# EasyEDA Pro project SmallStm.eprj

# Schematic SmallStm
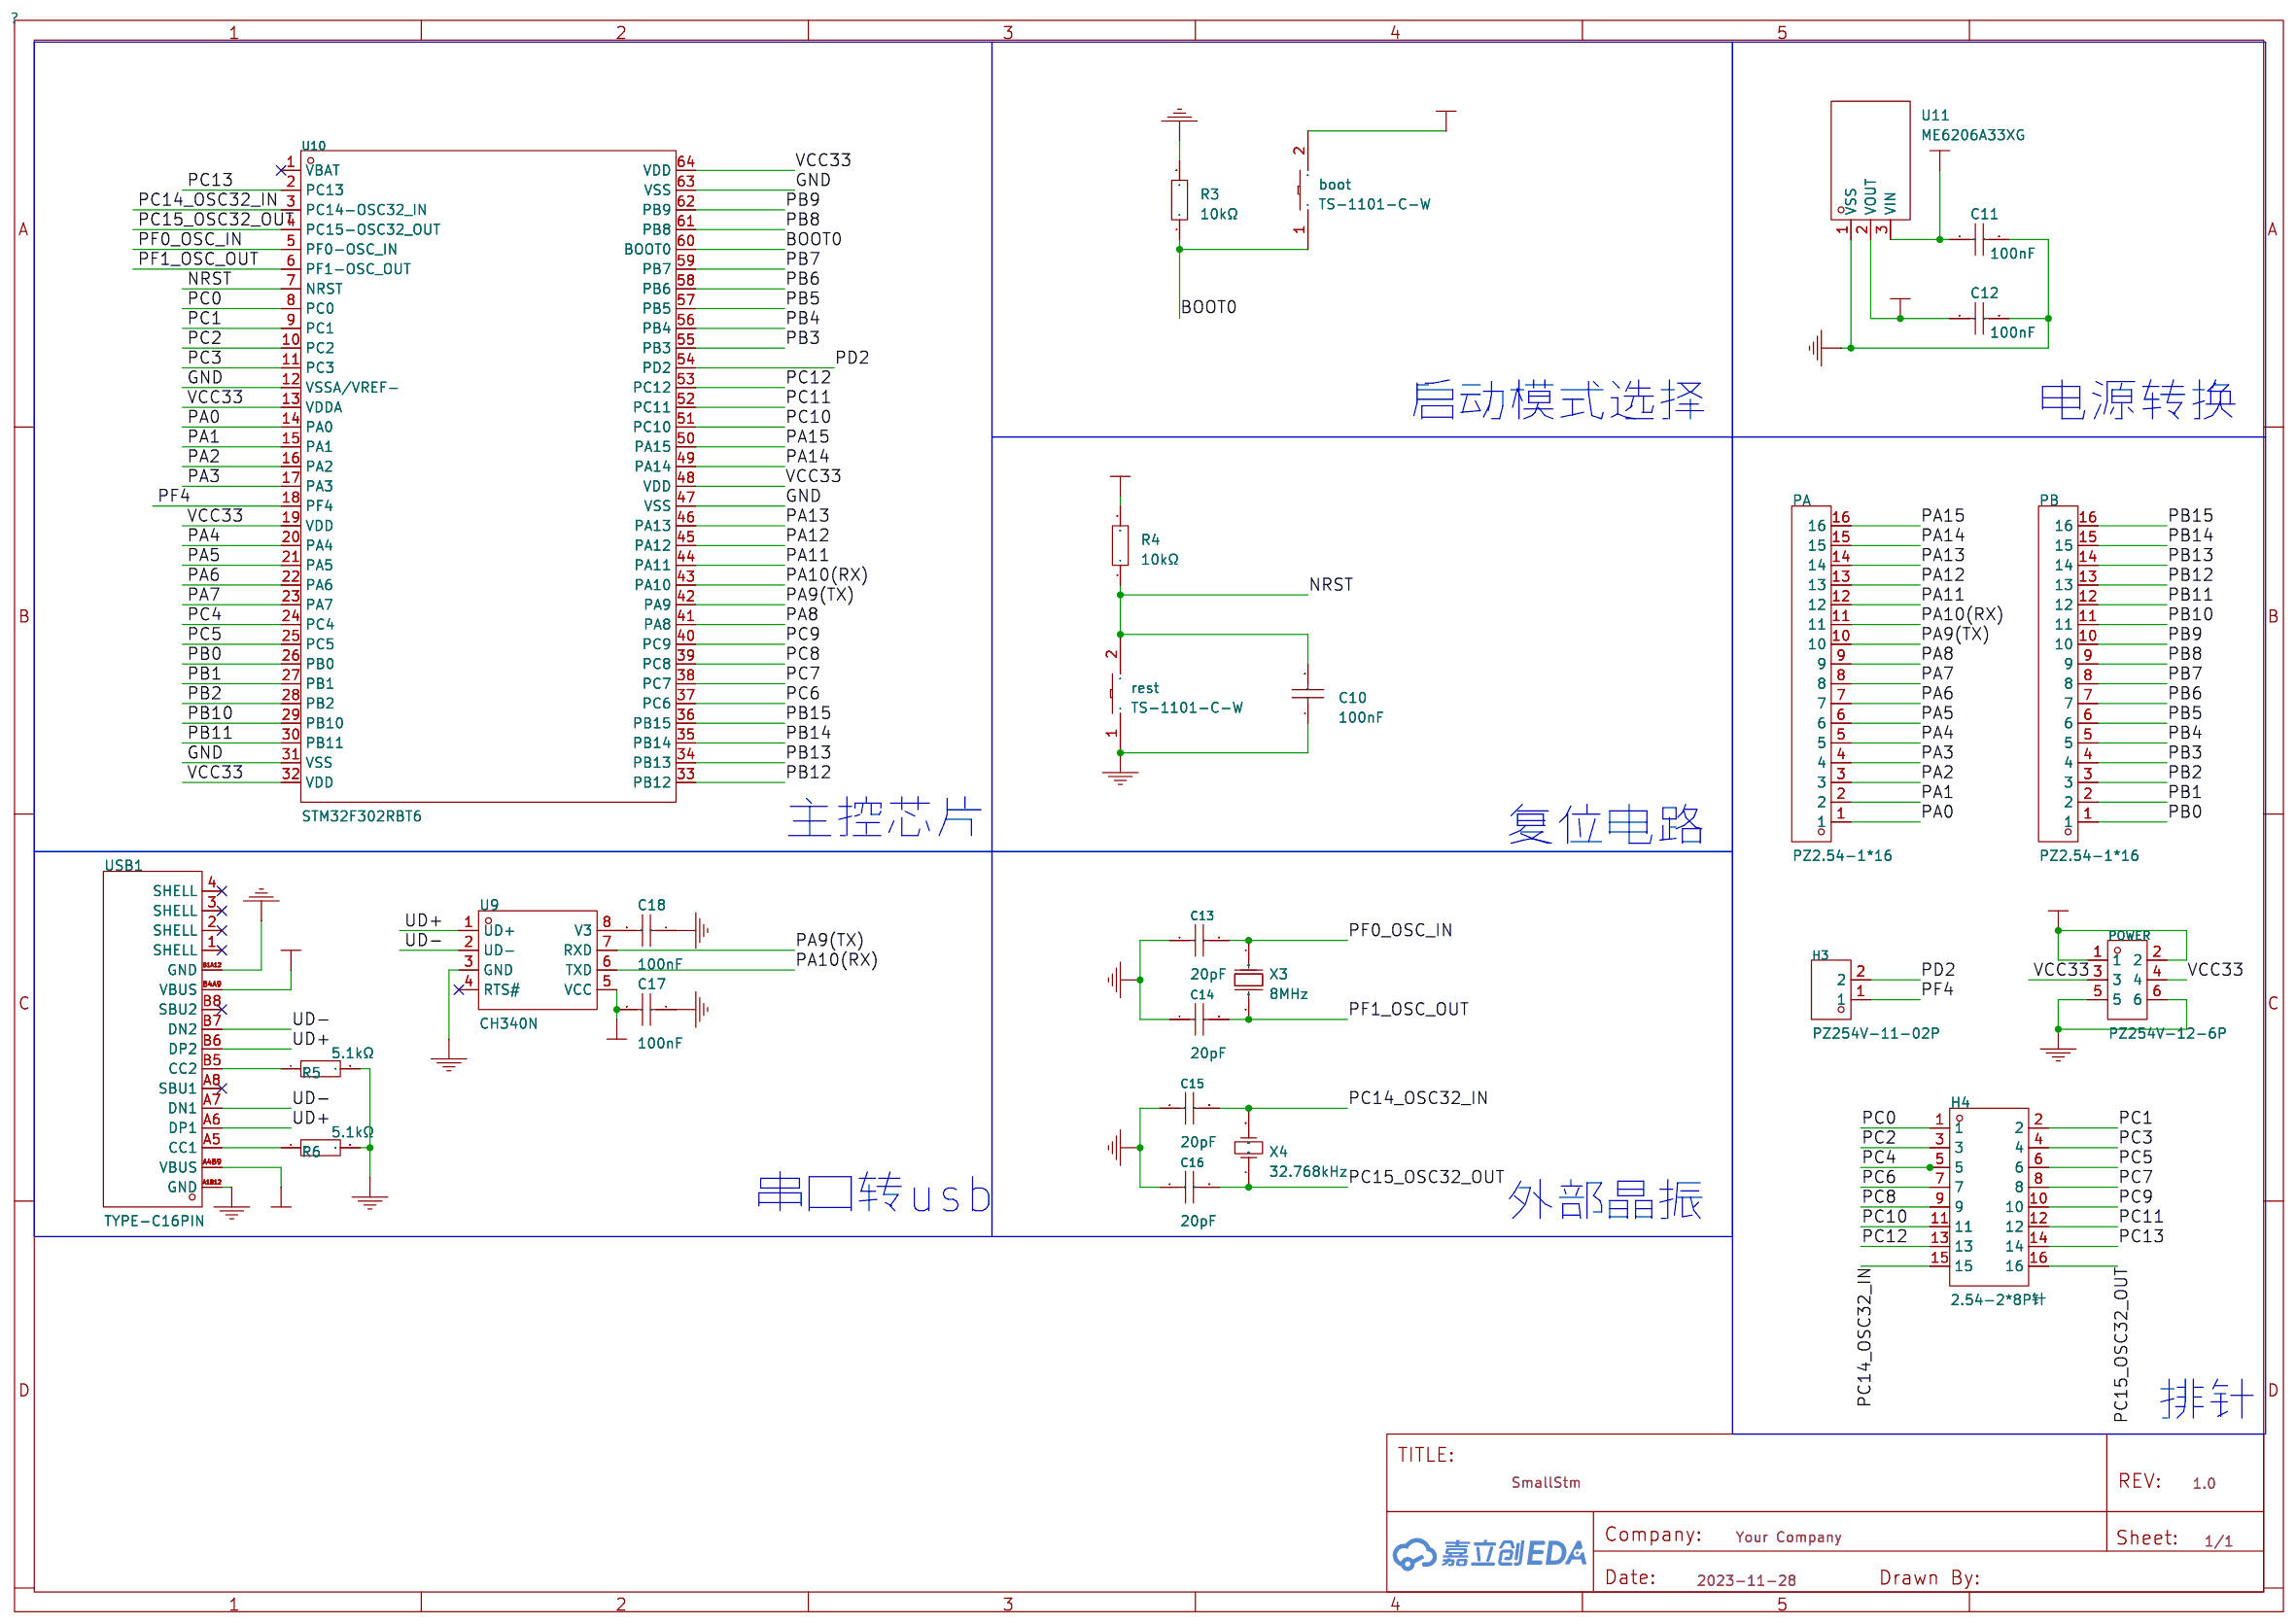
[diagram p0: schematic sheet]

## Parts
boot  TS-1101-C-W  [SW-SMD_L6.0-W3.3-LS8.0]
C10  100nF  [C0603]
C11  100nF  [C0805]
C12  100nF  [C0805]
C13  20pF  [C0402]
C14  20pF  [C0402]
C15  20pF  [C0402]
C16  20pF  [C0402]
C17  100nF  [C0603]
C18  100nF  [C0603]
H3  PZ254V-11-02P  [HDR-TH_2P-P2.54-V-M]
H4  2.54-2*8P针  [HDR-TH_16P-P2.54-V-M-R2-C8-S2.54]
PA  PZ2.54-1*16  [HDR-TH_16P-P2.54-V-M]
PB  PZ2.54-1*16  [HDR-TH_16P-P2.54-V-M]
POWER  PZ254V-12-6P  [HDR-TH_6P-P2.54-V-M-R2-C3-S2.54]
R3  10kΩ  [R0603]
R4  10kΩ  [R0603]
R5  5.1kΩ  [R0603]
R6  5.1kΩ  [R0603]
rest  TS-1101-C-W  [SW-SMD_L6.0-W3.3-LS8.0]
U9  CH340N  [SOP-8_L4.9-W3.9-P1.27-LS6.0-BL]
U10  STM32F302RBT6  [LQFP-64_L10.0-W10.0-P0.50-LS12.0-BL]
U11  ME6206A33XG  [SOT-23-3_L2.9-W1.6-P1.90-LS2.8-BR]
USB1  TYPE-C16PIN  [USB-C-SMD_TYPE-C16PIN]
X3  8MHz  [CRYSTAL-SMD_L11.5-W4.8-LS12.7]
X4  32.768kHz  [OSC-TH_BD3.1-P0.8-D0.3]

## Library data of the parts
boot rest = TS-1101-C-W: 电路结构:单刀单掷;带支架:否;触点电流:50mA;额定电压(AC):-;额定电压(DC):12V;额定功率:-;安装方式:立贴;绝缘电阻:-;带灯:无;作用力:260gf;机械寿命:5万次;; LCSC Part Name: 6*3.6*2.5mm 立贴 轻触开关 白色带淡绿按键 卷装; Supplier Part: C318938; Manufacturer: XKB Connectivity(中国星坤); Supplier Footprint: SMD; JLCPCB Part Class: Extended Part; Datasheet: https://atta.szlcsc.com/upload/public/pdf/source/20200227/C318938_C2E53B1EEDE37D980A33616AC086DE53.pdf; Supplier: LCSC; Circuit: 单刀单掷; Actuator Style: 矩形按钮; Switch Length: 6mm; Switch Width: 3.6mm; Switch Height: 2.5mm; Strike Gundam: 否; Contact Current: 50mA; Voltage Rating (DC): 12V; Mounting Style: 立贴; Actuator/Cap Color: 白色带淡绿; With Lamp: 无; Operating Force: 260gf; Mechanical Life: 5万次; Operating Temperature: -30℃~+85℃
C10 C17 C18 = 0603B104K500NT: 容值:100nF;精度:±10%;额定电压:50V;材质(温度系数):X7R;; LCSC Part Name: 100nF ±10% 50V; Supplier Part: C30926; Manufacturer: FH(风华); Supplier Footprint: 0603; JLCPCB Part Class: Extended Part; Datasheet: https://atta.szlcsc.com/upload/public/pdf/source/20170923/C30926_1506149436298988724.pdf; Supplier: LCSC; Tolerance: ±10%; Voltage Rated: 50V; Temperature Coefficient: X7R
C11 C12 = 0805B104K500NT: 容值:100nF;精度:±10%;额定电压:50V;材质(温度系数):X7R;; LCSC Part Name: 100nF ±10% 50V; Supplier Part: C38141; Manufacturer: FH(风华); Supplier Footprint: 0805; JLCPCB Part Class: Extended Part; Datasheet: https://atta.szlcsc.com/upload/public/pdf/source/20170923/C38141_1506149447419988747.pdf; Supplier: LCSC; Tolerance: ±10%; Voltage Rated: 50V; Temperature Coefficient: X7R
C13-C16 = 0402CG200J500NT: 容值:20pF;精度:±5%;额定电压:50V;材质(温度系数):C0G;; LCSC Part Name: 20pF ±5% 50V; Supplier Part: C1554; Manufacturer: FH(风华); Supplier Footprint: 0402; JLCPCB Part Class: Basic Part; Datasheet: https://atta.szlcsc.com/upload/public/pdf/source/20200305/C486355_26A10D38EF8C2A5C37091D0039909270.pdf; Supplier: LCSC; Tolerance: ±5%; Voltage Rated: 50V; Temperature Coefficient: C0G
H3 = PZ254V-11-02P: 排数:单排;总PIN位数:2P;间距:2.54mm;插针结构:1x2P;行距:-;安装类型:直插;圆针/方针:方针;额定电流:-;额定电压:-;配合针长度:6mm;塑高:2.5mm;端接针长度:3mm;触头材质:黄铜;触头镀层:-;工作温度范围:-40℃~+105℃;颜色:黑色;; LCSC Part Name: 2.54mm 1x2P 直插 方针; Supplier Part: C492401; Manufacturer: XFCN(兴飞); Supplier Footprint: 插件,P=2.54mm; JLCPCB Part Class: Extended Part; Datasheet: https://atta.szlcsc.com/upload/public/pdf/source/20200309/C492401_A812433581A9B211A7FFA413ADDFF0E5.pdf; Supplier: LCSC; Number of Rows: 单排; Number of Pins: 2P; Pitch: 2.54mm; Pin Structure: 1x2P; Mounting Type: 直插; Circluar Pins/Square Pins: 方针; Length of Mating Pin: 6mm; Insulation Height: 2.5mm; Length of End Connection Pin: 3mm; Contact Material: 黄铜; Operating Temperature Range: -40℃~+105℃; Color: 黑色
H4 = 2.54-2*8P针_C779499: 圆针/方针:-;额定电流:-;额定电压:-;配合针长度:-;塑高:-;触头材质:-;; LCSC Part Name: 双排直插 2*8排针 2.54mm; Supplier Part: C779499; Manufacturer: BOOMELE(博穆精密); Supplier Footprint: 插件,P=2.54mm; JLCPCB Part Class: Extended Part; Datasheet: https://atta.szlcsc.com/upload/public/pdf/source/20221201/C605E3BE9C0F7226363017EFD1BDE852.pdf; Supplier: LCSC
PA PB = PZ2.54-1*16: LCSC Part Name: 排针 2.54mm 1x16P镀金; Supplier Part: C5360903; Manufacturer: ZHOURI(洲日); Supplier Footprint: DIP; Supplier: LCSC
POWER = PZ254V-12-6P: 排数:双排;总PIN位数:6P;间距:2.54mm;插针结构:2x3P;行距:2.54mm;安装类型:直插;圆针/方针:方针;额定电流:-;额定电压:-;配合针长度:6mm;塑高:2.5mm;端接针长度:3mm;触头材质:黄铜;触头镀层:-;工作温度范围:-40℃~+105℃;颜色:黑色;; LCSC Part Name: 2.54mm 2x3P 直插 方针; Supplier Part: C492420; Manufacturer: XFCN(兴飞); Supplier Footprint: 插件,P=2.54mm; JLCPCB Part Class: Extended Part; Datasheet: https://atta.szlcsc.com/upload/public/pdf/source/20200309/C492420_BAECB307B001054C09D200388220EAE6.pdf; Supplier: LCSC; Number of Rows: 双排; Number of Pins: 6P; Pitch: 2.54mm; Pin Structure: 2x3P; Row Spacing: 2.54mm; Mounting Type: 直插; Circluar Pins/Square Pins: 方针; Length of Mating Pin: 6mm; Insulation Height: 2.5mm; Length of End Connection Pin: 3mm; Contact Material: 黄铜; Operating Temperature Range: -40℃~+105℃; Color: 黑色
R3 R4 = 0603WAF1002T5E: 阻值:10kΩ;精度:±1%;功率:100mW;温度系数:±100ppm/℃;电阻类型:厚膜电阻;; LCSC Part Name: 10kΩ ±1% 100mW 厚膜电阻; Supplier Part: C25804; Manufacturer: UNI-ROYAL(厚声); Supplier Footprint: 0603; JLCPCB Part Class: Basic Part; Datasheet: https://atta.szlcsc.com/upload/public/pdf/source/20200306/C422600_1E6D84923E4A46A82E41ADD87F860B5C.pdf; Supplier: LCSC; Tolerance: ±1%; Power(Watts): 100mW; Overload Voltage (Max): 75V; Temperature Coefficient: ±100ppm/℃; Type: 厚膜电阻; Operating Temperature Range: -55℃~+155℃
R5 R6 = 0603WAF5101T5E: 阻值:5.1kΩ;精度:±1%;功率:100mW;温度系数:±100ppm/℃;电阻类型:厚膜电阻;; LCSC Part Name: 5.1kΩ ±1% 100mW 厚膜电阻; Supplier Part: C23186; Manufacturer: UNI-ROYAL(厚声); Supplier Footprint: 0603; JLCPCB Part Class: Basic Part; Datasheet: https://atta.szlcsc.com/upload/public/pdf/source/20200306/C422600_1E6D84923E4A46A82E41ADD87F860B5C.pdf; Supplier: LCSC; Tolerance: ±1%; Power(Watts): 100mW; Overload Voltage (Max): 75V; Temperature Coefficient: ±100ppm/℃; Type: 厚膜电阻; Operating Temperature Range: -55℃~+155℃
U9 = CH340N: LCSC Part Name: USB转串口芯片 CH340; Supplier Part: C2977777; Manufacturer: WCH(南京沁恒); Supplier Footprint: SOP-8; JLCPCB Part Class: Extended Part; Datasheet: https://atta.szlcsc.com/upload/public/pdf/source/20230530/6E401E9554E9F5311886CC8B3F89B62E.pdf; Supplier: LCSC
U10 = STM32F302RBT6: CPU内核:ARM Cortex-M4;CPU最大主频:72MHz;工作电压范围:2V~3.6V;程序存储容量:128KB;程序存储器类型:FLASH;RAM总容量:32KB;GPIO端口数量:52;; Supplier Part: C915559; Manufacturer: ST(意法半导体); Supplier Footprint: LQFP-64(10x10); JLCPCB Part Class: Extended Part; Datasheet: https://atta.szlcsc.com/upload/public/pdf/source/20201118/C915559_8F62CF0CC919D825BFE6EAA2D3BA6178.pdf; Supplier: LCSC; CPU Core: ARM Cortex-M4; CPU Maximum Speed: 72MHz; Operating Voltage Range: 2V~3.6V; Program Storage Size: 128KB; Program Memory Type: FLASH; RAM Size: 32KB; GPIO Ports Number: 52; ADC (Bit): 12bit; DAC (Bit): 12bit; Universal Serial Bus: 有; Peripheral/Function: DMA；看门狗；看门狗; Watchdog: 有; Infrared Data Association: 有; Low-Voltage Detect: 有; Direct Memory Access: 有; Internal Oscillator: 有; Operating Temperature Range: -40℃~+85℃
U11 = ME6206A33XG: 输出类型:固定;输出极性:正;最大输入电压:6V;输出电压:3.3V;输出电流:300mA;电源纹波抑制比(PSRR):50dB@(1kHz);; LCSC Part Name: 输入6V 输出3.3V 300mA; Supplier Part: C161345; Manufacturer: MICRONE(南京微盟); Supplier Footprint: SOT-23; JLCPCB Part Class: Extended Part; Datasheet: https://atta.szlcsc.com/upload/public/pdf/source/20180207/C161345_15179949863651359188.pdf; Supplier: LCSC; Output Type: 固定; Output Polarity: 正; Number of Outputs: 1; Maximum Input Voltage: 6V; Output Voltage: 3.3V; Dropout Voltage: 400mV@(200mA); Output Current: 300mA; Power Supply Rejection Ratio (PSRR): 50dB@(1kHz)
USB1 = TYPE-C16PIN: 连接器类型:Type-C;标准:-;公母:母;触点数量:16P;端口数量:1;安装方式:卧贴;额定电流 - 电源:3A;工作温度范围:-40℃~+85℃;; LCSC Part Name: Type-C 母 卧贴 快充闪充; Supplier Part: C393939; Manufacturer: SHOU HAN(首韩); Supplier Footprint: SMD; JLCPCB Part Class: Extended Part; Datasheet: https://atta.szlcsc.com/upload/public/pdf/source/20190521/C393939_7B9043D4CF1026AF443AB60D91FBCD5C.pdf; Supplier: LCSC; Connector Type: Type-C; Gender: 母; Number of Contacts: 16P; Number of Ports: 1; Mounting Style: 卧贴; Current Rating - Power (Max): 3A; Operating Temperature Range: -40℃~+85℃
X3 = X49SM8MSD2SC: 频率:8MHz;负载电容:20pF;频率公差:±20ppm;; LCSC Part Name: 8MHz ±20ppm 20pF HC-49SMD; Supplier Part: C12674; Manufacturer: YXC(扬兴晶振); Supplier Footprint: HC-49S-SMD; JLCPCB Part Class: Basic Part; Datasheet: https://atta.szlcsc.com/upload/public/pdf/source/20210329/C106809_0E91E60850A780B284B63D653DC40EA4.pdf; Supplier: LCSC; Crystal Type: 49SMD; Load Capacitance: 20pF; Frequency Tolerance: ±20ppm; Frequency Stability: ±30ppm; Operating Temperature: -20℃~+70℃
X4 = X308032768KGB2SC: 频率:32.768kHz;负载电容:12.5pF;频率公差:±10ppm;; LCSC Part Name: 32.768kHz ±10ppm 12.5pF YT-38; Supplier Part: C52082; Manufacturer: YXC(扬兴晶振); Supplier Footprint: DT-38; JLCPCB Part Class: Extended Part; Datasheet: https://atta.szlcsc.com/upload/public/pdf/source/20210729/394323D37097DADF5DA3ECA9C1DCF4BF.pdf; Supplier: LCSC; Crystal Type: 圆柱体晶振; Load Capacitance: 12.5pF; Frequency Tolerance: ±10ppm; Operating Temperature: -20℃~+70℃

## Nets
GND: C10.1 C11.2 C12.2 C13.1 C14.1 C15.1 C16.1 C17.1 C18.1 POWER.5 POWER.6 R3.2 R5.2 R6.2 rest.1 U9.3(GND) U10.12(VSSA/VREF-) U10.31(VSS) U10.47(VSS) U10.63(VSS) U11.1(VSS) USB1.A1B12(GND) USB1.B1A12(GND)
VCC5: C11.1 C17.2 POWER.1 POWER.2 U9.5(VCC) U11.3(VIN) USB1.A4B9(VBUS) USB1.B4A9(VBUS)
VCC33: boot.2 C12.1 POWER.3 POWER.4 R4.2 U10.13(VDDA) U10.19(VDD) U10.32(VDD) U10.48(VDD) U10.64(VDD) U11.2(VOUT)
BOOT0: boot.1 R3.1 U10.60(BOOT0)
NRST: C10.2 R4.1 rest.2 U10.7(NRST)
PA0: PA.1 U10.14(PA0)
PA1: PA.2 U10.15(PA1)
PA2: PA.3 U10.16(PA2)
PA3: PA.4 U10.17(PA3)
PA4: PA.5 U10.20(PA4)
PA5: PA.6 U10.21(PA5)
PA6: PA.7 U10.22(PA6)
PA7: PA.8 U10.23(PA7)
PA8: PA.9 U10.41(PA8)
PA9(TX): PA.10 U9.7(RXD) U10.42(PA9)
PA10(RX): PA.11 U9.6(TXD) U10.43(PA10)
PA11: PA.12 U10.44(PA11)
PA12: PA.13 U10.45(PA12)
PA13: PA.14 U10.46(PA13)
PA14: PA.15 U10.49(PA14)
PA15: PA.16 U10.50(PA15)
PB0: PB.1 U10.26(PB0)
PB1: PB.2 U10.27(PB1)
PB2: PB.3 U10.28(PB2)
PB3: PB.4 U10.55(PB3)
PB4: PB.5 U10.56(PB4)
PB5: PB.6 U10.57(PB5)
PB6: PB.7 U10.58(PB6)
PB7: PB.8 U10.59(PB7)
PB8: PB.9 U10.61(PB8)
PB9: PB.10 U10.62(PB9)
PB10: PB.11 U10.29(PB10)
PB11: PB.12 U10.30(PB11)
PB12: PB.13 U10.33(PB12)
PB13: PB.14 U10.34(PB13)
PB14: PB.15 U10.35(PB14)
PB15: PB.16 U10.36(PB15)
PC0: H4.1 U10.8(PC0)
PC1: H4.2 U10.9(PC1)
PC2: H4.3 U10.10(PC2)
PC3: H4.4 U10.11(PC3)
PC4: H4.5 U10.24(PC4)
PC5: H4.6 U10.25(PC5)
PC6: H4.7 U10.37(PC6)
PC7: H4.8 U10.38(PC7)
PC8: H4.9 U10.39(PC8)
PC9: H4.10 U10.40(PC9)
PC10: H4.11 U10.51(PC10)
PC11: H4.12 U10.52(PC11)
PC12: H4.13 U10.53(PC12)
PC13: H4.14 U10.2(PC13)
PC14_OSC32_IN: C15.2 H4.15 U10.3(PC14-OSC32_IN) X4.2(OSC2)
PC15_OSC32_OUT: C16.2 H4.16 U10.4(PC15-OSC32_OUT) X4.1(OSC1)
PD2: H3.2 U10.54(PD2)
PF0_OSC_IN: C13.2 U10.5(PF0-OSC_IN) X3.1(OSC1)
PF1_OSC_OUT: C14.2 U10.6(PF1-OSC_OUT) X3.2(OSC2)
PF4: H3.1 U10.18(PF4)
UD+: U9.1(UD+) USB1.A6(DP1) USB1.B6(DP2)
UD-: U9.2(UD-) USB1.A7(DN1) USB1.B7(DN2)
$1N492: R5.1 USB1.B5(CC2)
$1N493: R6.1 USB1.A5(CC1)
$1N4015: C18.2 U9.8(V3)

Not connected (* = marked no-connect by the designer): U9 4(RTS#)*; U10 1(VBAT)*; USB1 1(SHELL)* 2(SHELL)* 3(SHELL)* 4(SHELL)* A8(SBU1)* B8(SBU2)*

## Notes on the sheet
- 启动模式选择
- 电源转换
- 主控芯片
- 复位电路
- 串口转usb
- 外部晶振
- 排针

# Board PCB3
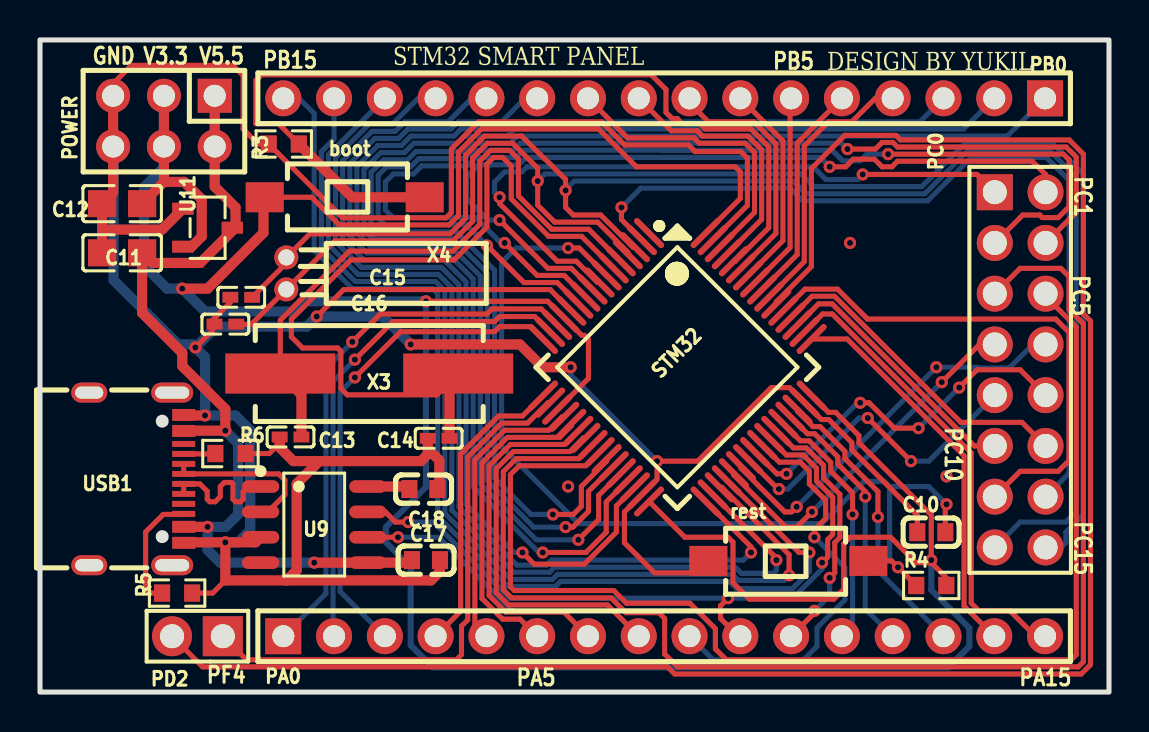
[diagram p1: board, top side]
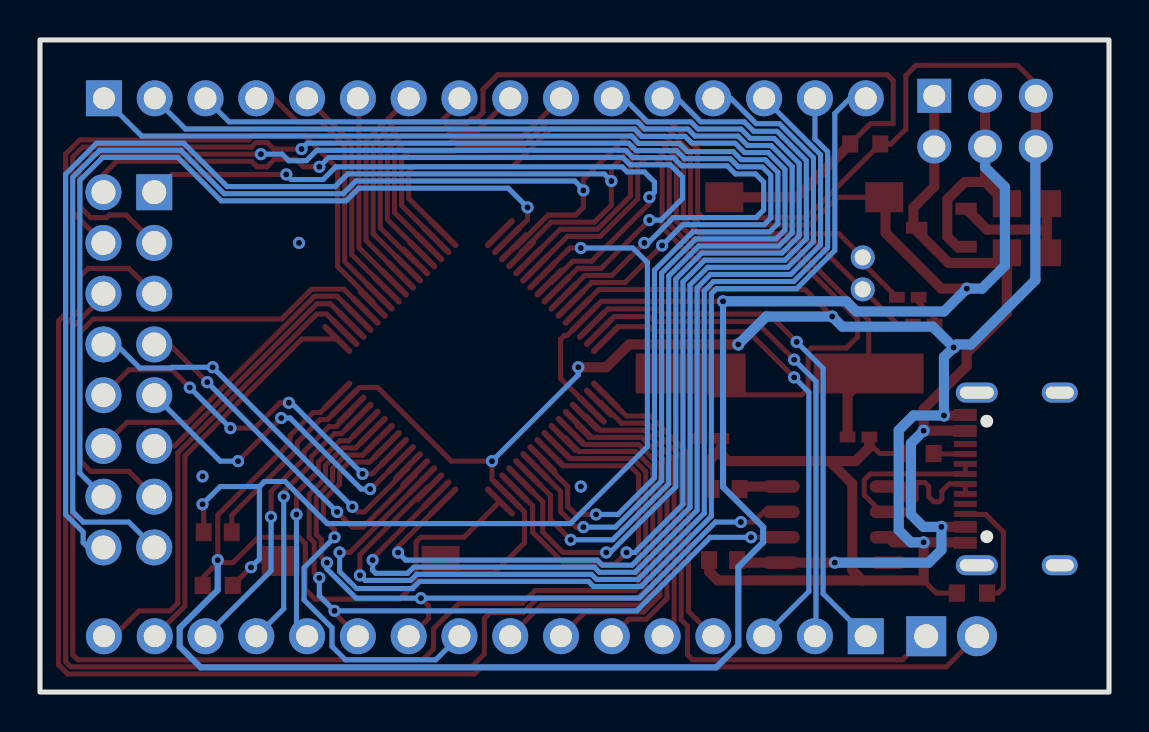
[diagram p2: board, bottom side, seen from below]

Outline 53.47 x 32.64 mm; copper layers: Top Layer, Bottom Layer. Coordinates in mm from the lower left corner of the outline.
Outline path: rectangle 0,32.64 53.47,0
Stack: Top Layer 0.035mm / Dielectric1 1.51mm FR4 er 4.5 / Bottom Layer 0.035mm

## Design rules (mm)
template: JLCPCB Capability(Two Layers Board)
spacing copperThickness1oz (default): track to track 0.102, other pairs 0.152 to 0.3
spacing copperThickness2oz: track to track 0.203, other pairs 0.152 to 0.3
track width copperThickness1oz (default): min 0.127, default 0.254, max 2.54
track width copperThickness2oz: min 0.203, default 0.254, max 2.54
differential pair differentialPair (default): width min 0.127, default 0.254, max 2.54; gap min 0.152, default 0.152
via viaSize (default): diameter min 0.5, default 0.61, max 10; hole min 0.3, default 0.305, max 6.3

## Placement (name value [footprint] x y rotation side)
boot  TS-1101-C-W  [SW-SMD_L6.0-W3.3-LS8.0]  15.24 24.77 180 top
C10  100nF  [C0603]  44.58 8 0 top
C11  100nF  [C0805]  4.11 21.99 180 top
C12  100nF  [C0805]  4.11 24.44 180 top
C13  20pF  [C0402]  12.53 12.77 0 top
C14  20pF  [C0402]  19.94 12.7 0 top
C15  20pF  [C0402]  10.07 19.76 0 top
C16  20pF  [C0402]  9.27 18.41 0 top
C17  100nF  [C0603]  19.3 6.6 180 top
C18  100nF  [C0603]  19.18 10.16 180 top
PA0  PZ2.54-1*16  [HDR-TH_16P-P2.54-V-M]  31.22 2.79 0 top
PB0  PZ2.54-1*16  [HDR-TH_16P-P2.54-V-M]  31.22 29.72 180 top
PC0  2.54-2*8P针  [HDR-TH_16P-P2.54-V-M-R2-C8-S2.54]  49.02 16.13 270 top
PD2  PZ254V-11-02P  [HDR-TH_2P-P2.54-V-M]  7.87 2.79 180 top
POWER  PZ254V-12-6P  [HDR-TH_6P-P2.54-V-M-R2-C3-S2.54]  6.2 28.58 180 top
R3  10kΩ  [R0603]  12.19 27.43 180 top
R4  10kΩ  [R0603]  44.58 5.33 0 top
R5  5.1kΩ  [R0603]  6.86 4.95 0 top
R6  5.1kΩ  [R0603]  9.52 11.94 0 top
rest  TS-1101-C-W  [SW-SMD_L6.0-W3.3-LS8.0]  37.43 6.56 0 top
STM32  STM32F302RBT6  [LQFP-64_L10.0-W10.0-P0.50-LS12.0-BL]  31.88 16.26 225 top
U9  CH340N  [SOP-8_L4.9-W3.9-P1.27-LS6.0-BL]  13.72 8.38 270 top
U11  ME6206A33XG  [SOT-23-3_L2.9-W1.6-P1.90-LS2.8-BR]  8.38 23.24 180 top
USB1  TYPE-C16PIN  [USB-C-SMD_TYPE-C16PIN]  4.83 10.67 270 top
X3  8MHz  [CRYSTAL-SMD_L11.5-W4.8-LS12.7]  16.47 15.94 0 top
X4  32.768kHz  [OSC-TH_BD3.1-P0.8-D0.3]  12.32 20.95 180 top

## Footprints (pads in the part's own frame, mm; a bottom-side part is the same pattern mirrored in y, then rotated)
C0402
  rect 0.79x0.54 smd: 1(-0.545,0) 2(0.545,0)
C0603
  rect 0.8x0.9 smd: 1(-0.7,0) 2(0.7,0)
C0805
  rect 1.41x1.35 smd: 1(-1,0) 2(1,0)
CRYSTAL-SMD_L11.5-W4.8-LS12.7
  rect 5.5x2 smd: 1(-4.45,0) 2(4.45,0)
HDR-TH_2P-P2.54-V-M
  rect 2x2 hole 1.2: 1(-1.27,0)
  round 2 hole 1.2: 2(1.27,0)
HDR-TH_6P-P2.54-V-M-R2-C3-S2.54
  rect 1.7x1.7 hole 1.1: 1(-2.54,-1.27)
  round 1.7 hole 1.1: 2(-2.54,1.27) 3(0,-1.27) 4(0,1.27) 5(2.54,-1.27) 6(2.54,1.27)
HDR-TH_16P-P2.54-V-M
  rect 1.8x1.8 hole 1.1: 1(-19.05,0)
  round 1.8 hole 1.1: 2(-16.51,0) 3(-13.97,0) 4(-11.43,0) 5(-8.89,0) 6(-6.35,0) 7(-3.81,0) 8(-1.27,0) 9(1.27,0) 10(3.81,0) 11(6.35,0) 12(8.89,0) 13(11.43,0) 14(13.97,0) 15(16.51,0) 16(19.05,0)
HDR-TH_16P-P2.54-V-M-R2-C8-S2.54
  rect 1.8x1.8 hole 1.2: 1(-8.89,-1.27)
  round 1.8 hole 1.2: 2(-8.89,1.27) 3(-6.35,-1.27) 4(-6.35,1.27) 5(-3.81,-1.27) 6(-3.81,1.27) 7(-1.27,-1.27) 8(-1.27,1.27) 9(1.27,-1.27) 10(1.27,1.27) 11(3.81,-1.27) 12(3.81,1.27) 13(6.35,-1.27) 14(6.35,1.27) 15(8.89,-1.27) 16(8.89,1.27)
LQFP-64_L10.0-W10.0-P0.50-LS12.0-BL
  oval 0.3x2 smd: 1(-3.75,-5.75) 2(-3.25,-5.75) 3(-2.75,-5.75) 4(-2.25,-5.75) 5(-1.75,-5.75) 6(-1.25,-5.75) 7(-0.75,-5.75) 8(-0.25,-5.75) 9(0.25,-5.75) 10(0.75,-5.75) 11(1.25,-5.75) 12(1.75,-5.75) 13(2.25,-5.75) 14(2.75,-5.75) 15(3.25,-5.75) 16(3.75,-5.75) 33(3.75,5.75) 34(3.25,5.75) 35(2.75,5.75) 36(2.25,5.75) 37(1.75,5.75) 38(1.25,5.75) 39(0.75,5.75) 40(0.25,5.75) 41(-0.25,5.75) 42(-0.75,5.75) 43(-1.25,5.75) 44(-1.75,5.75) 45(-2.25,5.75) 46(-2.75,5.75) 47(-3.25,5.75) 48(-3.75,5.75)
  oval 2x0.3 smd: 17(5.75,-3.75) 18(5.75,-3.25) 19(5.75,-2.75) 20(5.75,-2.25) 21(5.75,-1.75) 22(5.75,-1.25) 23(5.75,-0.75) 24(5.75,-0.25) 25(5.75,0.25) 26(5.75,0.75) 27(5.75,1.25) 28(5.75,1.75) 29(5.75,2.25) 30(5.75,2.75) 31(5.75,3.25) 32(5.75,3.75) 49(-5.75,3.75) 50(-5.75,3.25) 51(-5.75,2.75) 52(-5.75,2.25) 53(-5.75,1.75) 54(-5.75,1.25) 55(-5.75,0.75) 56(-5.75,0.25) 57(-5.75,-0.25) 58(-5.75,-0.75) 59(-5.75,-1.25) 60(-5.75,-1.75) 61(-5.75,-2.25) 62(-5.75,-2.75) 63(-5.75,-3.25) 64(-5.75,-3.75)
OSC-TH_BD3.1-P0.8-D0.3
  round 1.2 hole 0.8: 1(0,0.8) 2(0,-0.8)
R0603
  rect 0.806x0.864 smd: 1(-0.753,0) 2(0.753,0)
SOP-8_L4.9-W3.9-P1.27-LS6.0-BL
  oval 0.63x1.865 smd: 1(-1.905,-2.683) 2(-0.635,-2.683) 3(0.635,-2.683) 4(1.905,-2.683) 5(1.905,2.683) 6(0.635,2.683) 7(-0.635,2.683) 8(-1.905,2.683)
SOT-23-3_L2.9-W1.6-P1.90-LS2.8-BR
  rect 1.07x0.6 smd: 1(1.235,-0.95) 2(1.235,0.95) 3(-1.235,0)
SW-SMD_L6.0-W3.3-LS8.0
  rect 1.9x1.5 smd: 1(-4,0) 2(4,0)
USB-C-SMD_TYPE-C16PIN
  oval 1x2.1 hole 0.6x1.7: 1(-4.32,1.788) 2(4.32,1.788)
  oval 1x1.8 hole 0.6x1.4: 3(-4.32,-2.362) 4(4.32,-2.362)
  rect 0.6x1.15 smd: A1B12(-3.2,2.362) A4B9(-2.4,2.362) B1A12(3.2,2.362) B4A9(2.4,2.362)
  rect 0.3x1.15 smd: A5(-1.25,2.362) A6(-0.25,2.362) A7(0.25,2.362) A8(-1.75,2.362) B5(1.75,2.362) B6(0.75,2.362) B7(-0.75,2.362) B8(1.25,2.362)

## Nets
GND: C10.1 C11.2 C12.2 C13.1 C14.1 C15.1 C16.1 C17.1 C18.1 POWER.5 POWER.6 R3.2 R5.2 R6.2 rest.1 STM32.12 STM32.31 STM32.47 STM32.63 U9.3 U11.1 USB1.A1B12 USB1.B1A12
VCC5: C11.1 C17.2 POWER.1 POWER.2 U9.5 U11.3 USB1.A4B9 USB1.B4A9
VCC33: boot.2 C12.1 POWER.3 POWER.4 R4.2 STM32.13 STM32.19 STM32.32 STM32.48 STM32.64 U11.2
BOOT0: boot.1 R3.1 STM32.60
NRST: C10.2 R4.1 rest.2 STM32.7
PA0: PA0.1 STM32.14
PA1: PA0.2 STM32.15
PA2: PA0.3 STM32.16
PA3: PA0.4 STM32.17
PA4: PA0.5 STM32.20
PA5: PA0.6 STM32.21
PA6: PA0.7 STM32.22
PA7: PA0.8 STM32.23
PA8: PA0.9 STM32.41
PA9(TX): PA0.10 STM32.42 U9.7
PA10(RX): PA0.11 STM32.43 U9.6
PA11: PA0.12 STM32.44
PA12: PA0.13 STM32.45
PA13: PA0.14 STM32.46
PA14: PA0.15 STM32.49
PA15: PA0.16 STM32.50
PB0: PB0.1 STM32.26
PB1: PB0.2 STM32.27
PB2: PB0.3 STM32.28
PB3: PB0.4 STM32.55
PB4: PB0.5 STM32.56
PB5: PB0.6 STM32.57
PB6: PB0.7 STM32.58
PB7: PB0.8 STM32.59
PB8: PB0.9 STM32.61
PB9: PB0.10 STM32.62
PB10: PB0.11 STM32.29
PB11: PB0.12 STM32.30
PB12: PB0.13 STM32.33
PB13: PB0.14 STM32.34
PB14: PB0.15 STM32.35
PB15: PB0.16 STM32.36
PC0: PC0.1 STM32.8
PC1: PC0.2 STM32.9
PC2: PC0.3 STM32.10
PC3: PC0.4 STM32.11
PC4: PC0.5 STM32.24
PC5: PC0.6 STM32.25
PC6: PC0.7 STM32.37
PC7: PC0.8 STM32.38
PC8: PC0.9 STM32.39
PC9: PC0.10 STM32.40
PC10: PC0.11 STM32.51
PC11: PC0.12 STM32.52
PC12: PC0.13 STM32.53
PC13: PC0.14 STM32.2
PC14_OSC32_IN: C15.2 PC0.15 STM32.3 X4.2
PC15_OSC32_OUT: C16.2 PC0.16 STM32.4 X4.1
PD2: PD2.2 STM32.54
PF0_OSC_IN: C13.2 STM32.5 X3.1
PF1_OSC_OUT: C14.2 STM32.6 X3.2
PF4: PD2.1 STM32.18
UD+: U9.1 USB1.A7 USB1.B6
UD-: U9.2 USB1.A6 USB1.B7
$1N492: R5.1 USB1.B5
$1N493: R6.1 USB1.A5
$1N4015: C18.2 U9.8

Pads without a net: STM32 1; U9 4; USB1 1 2 3 4 A8 B8

## Via types
v1: diameter 0.61, hole 0.305, Top Layer to Bottom Layer, 63 vias

## Routing (per net, layer and track width the routed paths; a pad name or vN(x,y) marks a point on that pad's centre or on a via; arc(x,y) is an arc through that point)
GND: length 196.5
  Top Layer w0.254: 11.99,12.46 11.47,11.94 R6.2 ; POWER.5 3.66,30.46 4.57,31.37 9.65,31.37 10.16,30.86 10.16,28.18 10.91,27.43 R3.2 15.14,23.74 20.31,23.74 20.57,24 20.57,27.18 21.93,28.54 28.08,28.54 29.24,27.38 32.44,27.38 32.77,27.05 35.05,27.05 35.38,26.72 35.38,24.36 STM32.63 ; v1(13.84,18.8) 15.19,20.14 25.52,20.14 STM32.12 ; R5.2 8.64,4.95 9.27,5.59 ; C10.1 43.88,8.85 40.61,12.12 40.61,12.48 39.45,13.64 39.09,13.64 STM32.47 37.49,15.24 36.58,15.24 32.89,11.56 v1(30.86,11.56) 30.86,10.64 STM32.31 29.23,9.01 29.23,7.47 30.73,5.97 32.83,5.97 rest.1 ; C15.1 9.52,19.51 8.63,18.62 8.63,18.11 v1(7.77,17.25)
  Top Layer w0.508: 3.11,23.15 C12.2 3.66,24.99 POWER.6 POWER.5 ; 3.11,23.15 C11.2 ; 3.11,23.15 6.1,23.15 U11.1 ; 19.39,12.18 19.39,11.9 19.05,11.56 13.97,11.56 ; 19.39,12.18 C14.1 ; 19.39,12.18 19.97,11.6 19.97,10.31 ; 13.97,11.56 12.84,10.42 12.84,6.1 12.33,5.59 ; 13.97,11.56 12.67,11.56 11.99,12.24 C13.1 ; v1(8.25,13.84) 7.21,13.84 USB1.A1B12 ; 12.33,5.59 9.27,5.59 v1(9.27,7.49) ; 12.33,5.59 19.56,5.59 20,6.03 C17.1 ; v1(18.54,17.4) 24,17.4 25.15,16.26 v1(26.54,16.26) ; v1(9.27,7.49) 7.21,7.49 USB1.B1A12 ; v1(9.27,7.49) 10.78,7.49 U9.3
  Bottom Layer w0.254: v1(30.86,11.56) 26.54,15.88 v1(26.54,16.26)
  Bottom Layer w0.508: v1(7.77,17.25) 8.81,18.29 13.33,18.29 v1(13.84,18.8) 17.14,18.8 v1(18.54,17.4) ; v1(7.77,17.25) 7.62,17.4 6.9,17.4 3.68,20.62 3.68,27.28 POWER.6 ; v1(7.77,17.25) 8.25,16.76 v1(8.25,13.84) 9.78,13.84 10.52,13.11 10.52,8.1 9.91,7.49 v1(9.27,7.49)
  vias: v1(26.42,10.29) v1(40.51,22.48) v1(45.34,10.8)
VCC5: length 44.5
  Top Layer w0.508: USB1.B4A9 v1(8.38,8.27) ; v1(13.72,6.48) U9.5 18.48,6.48 C17.2 ; USB1.A4B9 7.2,13.08 v1(9.27,13.08) 9.27,14.16 7.12,16.32 7.12,16.97 5.11,18.98 C11.1 5.14,21.99 5.65,21.48 8.02,21.48 9.78,23.24 9.78,24.26 8.74,25.3 POWER.2 POWER.1
  Bottom Layer w0.508: v1(9.27,13.08) 9.91,12.45 9.91,8.89 9.28,8.27 v1(8.38,8.27) 8.38,7.11 9.02,6.48 v1(13.72,6.48)
VCC33: length 171.3
  Top Layer w0.254: v1(19.3,19.56) 25.39,19.56 STM32.13 27.1,17.85 27.23,17.85 27.43,17.65 27.43,15.7 STM32.19 ; boot.2 13.59,24.77 14.97,23.38 20.45,23.38 20.93,23.86 20.93,27.03 22.08,28.18 27.94,28.18 29.83,26.29 34.77,26.29 35.03,26.03 35.03,24.71 STM32.64 ; 30.46,9.54 32.25,7.75 34.42,7.75 34.66,7.5 34.66,5.47 35.48,4.65 39.7,4.65 40.2,5.15 40.2,7.43 40.52,7.75 42.55,7.75 43.81,6.48 44.58,6.48 ; 44.58,6.48 45.58,5.47 45.58,5.33 ; 44.58,6.48 44.58,8.86 40.96,12.48 40.96,12.83 39.8,14 39.44,14 STM32.48
  Top Layer w0.508: U11.2 7.58,22.29 8.09,22.8 8.09,24.66 7.21,25.53 6.2,25.53 ; 6.2,25.53 C12.1 ; 6.2,25.53 POWER.4 POWER.3 ; boot.2 11.18,24.7 11.18,22.99 8.38,20.19 v1(7.11,20.19)
  Bottom Layer w0.305: v1(19.3,19.56) 19.3,10.26 17.3,8.25 17.3,7.49 18.54,6.25 18.54,2.34 19.64,1.23 45.43,1.23 46.48,2.29 46.48,3.2 44.58,5.11 v1(44.58,6.6)
  Bottom Layer w0.508: POWER.4 6.2,26.27 5.21,25.27 5.21,21.34 6.35,20.19 v1(7.11,20.19) 8.25,19.05 12.64,19.05 13.15,19.56 v1(19.3,19.56)
BOOT0: length 46.6
  Top Layer w0.254: R3.1 11.93,28.45 10.8,28.45 10.8,30.61 11.09,30.9 30.57,30.9 31.31,30.16 31.31,29.02 31.62,28.7 31.88,28.7 32.13,28.45 33.02,28.45 33.28,28.18 35.56,28.18 36.45,27.29 36.45,23.24 34.77,21.56 34.7,21.56
  Top Layer w0.508: R3.1 15.61,24.77 boot.1
NRST: length 49.1
  Top Layer w0.254: rest.2 42.59,6.56 v1(42.91,6.24) R4.1 ; C10.2 45.28,9.34 v1(45.34,9.4) ; STM32.7 26.97,22.22 v1(26.42,22.22)
  Bottom Layer w0.254: v1(42.91,6.24) 42.49,6.66 42.49,10.29 ; 42.49,10.29 44.45,10.29 v1(45.34,9.4) ; 42.49,10.29 42.24,10.54 41.21,10.54 39.1,8.43 26.94,8.43 23.09,12.28 23.09,21.5 23.81,22.22 v1(26.42,22.22)
PA0: length 27.4
  Top Layer w0.254: STM32.14 25.07,19.18 22.61,19.18 22.35,18.92 17.02,18.92 v1(15.62,17.53)
  Bottom Layer w0.254: PA0.1 14.3,4.93 14.3,16.21 v1(15.62,17.53)
PA1: length 25.3
  Top Layer w0.254: v1(15.75,16.64) 17.65,18.54 22.73,18.54 22.99,18.8 24.74,18.8 25.51,18.02
  Bottom Layer w0.254: v1(15.75,16.64) 14.66,15.55 14.66,2.85 PA0.2
PA2: length 24.9
  Top Layer w0.254: STM32.16 24.54,18.29 22.99,18.29 22.73,18.03 18.03,18.03 v1(15.75,15.75)
  Bottom Layer w0.254: v1(15.75,15.75) 15.01,15.01 15.01,5.03 PA0.3
PA3: length 15
  Top Layer w0.254: PA0.4 21.04,4.05 21.04,11.92 22.94,13.82 24.13,13.82 STM32.17
PA4: length 14.4
  Top Layer w0.254: PA0.5 21.75,3.37 21.75,11.62 23.23,13.1 25.44,13.1 26.12,13.78 STM32.20
PA5: length 15.7
  Top Layer w0.254: STM32.21 26.57,13.33 25.99,12.75 23.38,12.75 22.11,11.47 22.11,4.68 23.14,3.65 24.01,3.65 PA0.6
PA6: length 17.5
  Top Layer w0.254: STM32.22 26.25,12.39 23.53,12.39 22.46,11.33 22.46,4.83 23.29,4 26.2,4 PA0.7
PA7: length 19.3
  Top Layer w0.254: PA0.8 28.38,4.36 23.44,4.36 22.82,4.98 22.82,11.18 23.67,12.04 26.5,12.04 27.18,12.72 STM32.23
PA8: length 20.6
  Top Layer w0.254: STM32.41 36.98,11.51 38.02,11.51 38.48,11.05 38.48,10.41 39.29,9.6 39.29,8.69 38.73,8.13 v1(38.73,7.75)
  Bottom Layer w0.254: v1(38.73,7.75) 40.26,6.22 40.26,4.61 38.86,3.22 38.86,2.29 38.19,1.61 33.67,1.61 PA0.9
PA9(TX): length 36.2
  Top Layer w0.254: 36.47,12.72 37.33,11.86 38.17,11.86 38.84,11.2 38.84,10.56 39.65,9.75 39.65,7.88 39.4,7.63 39.4,6.76 v1(39.12,6.48) ; PA0.10 34.92,2.79 34.04,3.68 34.04,4.32 v1(34.42,4.7) ; v1(18.42,8.51) 17.78,8.51 17.27,9.02 U9.7
  Bottom Layer w0.254: v1(18.42,8.51) 19.68,8.51 23.49,4.7 v1(34.42,4.7) 37.65,4.7 39.12,6.16 v1(39.12,6.48)
PA10(RX): length 36.8
  Top Layer w0.254: STM32.43 37.68,12.22 38.32,12.22 39.19,11.35 39.19,10.71 40.01,9.9 40.01,7.74 39.75,7.48 39.75,5.97 v1(39.5,5.72) ; PA0.11 38.73,3.96 v1(38.73,4.06) ; v1(17.91,7.75) U9.6
  Bottom Layer w0.254: v1(39.5,5.72) 39.5,4.83 v1(38.73,4.06) 23.62,4.06 19.94,7.75 v1(17.91,7.75)
PA11: length 12.5
  Top Layer w0.254: v1(40.64,8.89) 40.64,9.97 39.55,11.06 39.55,11.5 38.47,12.57 38.03,12.57 STM32.44
  Bottom Layer w0.254: PA0.12 40.64,3.33 v1(40.64,8.89)
PA12: length 13.3
  Top Layer w0.254: STM32.45 38.39,12.93 38.74,12.93 39.9,11.77 39.9,11.41 41.27,10.04 v1(41.27,9.78)
  Bottom Layer w0.254: PA0.13 41.27,4.17 v1(41.27,9.78)
PA13: length 14.6
  Top Layer w0.254: v1(41.91,8.76) 41.91,10.03 40.26,11.68 40.26,12.04 39.02,13.29 38.66,13.29 37.89,14.06 STM32.46
  Bottom Layer w0.254: PA0.14 41.91,6.07 v1(41.91,8.76)
PA14: length 19.7
  Top Layer w0.254: STM32.49 40.37,17.67 46.22,11.83 46.22,4.3 PA0.15
PA15: length 23.5
  Top Layer w0.254: PA0.16 49.78,2.79 48.51,4.06 46.96,4.06 46.57,4.45 46.57,11.97 39.62,18.92 39.14,18.92 STM32.50
PB0: length 63.5
  Top Layer w0.254: STM32.26 28.34,11.56 27.08,10.3 27.08,9.3 26.67,8.89 v1(25.65,8.89)
  Bottom Layer w0.254: v1(25.65,8.89) 24.56,8.89 22.73,10.72 22.73,21.12 20.81,23.04 16.97,23.04 16.56,23.44 16.56,26.01 17.19,26.64 18.39,26.64 18.8,27.05 21.08,27.05 21.49,27.46 23.51,27.46 23.88,27.83 48.38,27.83 PB0.1
PB1: length 62.6
  Top Layer w0.254: STM32.27 27.43,10.04 27.43,9.04 26.65,8.25 v1(26.29,8.25)
  Bottom Layer w0.254: v1(26.29,8.25) 24.69,8.25 22.38,10.57 22.38,20.97 20.67,22.68 16.65,22.68 16.2,23.13 16.2,26.16 17.04,27 18.23,27 18.7,27.47 20.86,27.47 21.2,27.81 23.36,27.81 23.73,28.18 46.19,28.18 PB0.2
PB2: length 61.8
  Top Layer w0.254: v1(26.92,7.62) 27.94,8.64 27.94,9.84 29.05,10.95
  Bottom Layer w0.254: v1(26.92,7.62) 24.82,7.62 22.02,10.42 22.02,20.82 20.52,22.33 16.51,22.33 15.85,22.98 15.85,26.31 16.9,27.36 18.08,27.36 18.55,27.83 20.7,27.83 21.06,28.18 23.23,28.18 23.58,28.54 44.01,28.54 PB0.3
PB3: length 13.7
  Top Layer w0.254: PB0.4 41.78,29.72 40.6,28.54 39.43,28.54 38.23,27.33 38.23,21.55 36.47,19.79
PB4: length 11.2
  Top Layer w0.254: STM32.56 37.87,21.9 37.87,27.48 PB0.5
PB5: length 10
  Top Layer w0.254: STM32.57 37.52,22.25 37.52,29.67 PB0.6
PB6: length 10.5
  Top Layer w0.254: STM32.58 37.16,22.6 37.16,27.59 PB0.7
PB7: length 12.4
  Top Layer w0.254: PB0.8 32.49,29.48 33.43,28.54 35.7,28.54 36.8,27.44 36.8,22.95 35.06,21.21
PB8: length 13.2
  Top Layer w0.254: PB0.9 31.57,28.09 32.87,28.09 33.14,27.83 35.41,27.83 36.09,27.14 36.09,23.65 STM32.61
PB9: length 14.9
  Top Layer w0.254: PB0.10 29.39,27.74 32.71,27.74 32.98,27.47 35.26,27.47 35.74,27 35.74,24.01 STM32.62
PB10: length 43.3
  Top Layer w0.254: v1(25.15,6.98) 27.3,6.98 28.32,8 28.32,9.52 STM32.29
  Bottom Layer w0.254: PB0.11 24.26,29.72 23.08,28.54 20.91,28.54 20.56,28.18 18.4,28.18 17.93,27.71 16.75,27.71 15.49,26.46 15.49,22.83 16.36,21.97 20.37,21.97 21.67,20.68 21.67,10.27 24.96,6.98 v1(25.15,6.98)
PB11: length 42.6
  Top Layer w0.254: STM32.30 28.83,9.32 28.83,8.01 27.22,6.4 24.71,6.4 v1(24.13,6.98)
  Bottom Layer w0.254: v1(24.13,6.98) 23.72,6.98 21.31,9.39 21.31,20.53 20.22,21.62 16.21,21.62 15.14,22.69 15.14,26.6 16.6,28.07 17.77,28.07 18.24,28.54 20.41,28.54 21.59,29.72 PB0.12
PB12: length 48.2
  Top Layer w0.254: STM32.33 35.56,7.27 v1(35.56,6.98)
  Bottom Layer w0.254: v1(35.56,6.98) 35.18,6.6 25.59,6.6 25.34,6.35 23.85,6.35 20.95,9.25 20.95,20.38 20.08,21.26 16.06,21.26 14.78,22.54 14.78,26.75 16.48,28.45 17.65,28.45 18.92,29.72 PB0.13
PB13: length 49.6
  Top Layer w0.254: v1(36.83,6.6) 36.83,6.71 STM32.34
  Bottom Layer w0.254: v1(36.83,6.6) 36.83,6.1 36.68,5.94 35.08,5.94 34.77,6.25 25.74,6.25 25.48,5.99 23.7,5.99 20.6,9.1 20.6,20.23 19.93,20.9 15.92,20.9 14.43,22.39 14.43,26.9 PB0.14
PB14: length 50.8
  Top Layer w0.254: v1(37.46,5.84) 37.46,6.88 34.1,10.25 STM32.35
  Bottom Layer w0.254: PB0.15 14.71,27.68 14.07,27.04 14.07,22.25 15.77,20.55 19.78,20.55 20.24,20.09 20.24,8.95 23.56,5.64 25.63,5.64 25.89,5.89 34.63,5.89 34.93,5.59 37.21,5.59 v1(37.46,5.84)
PB15: length 54.2
  Top Layer w0.254: STM32.36 37.97,6.98 v1(38.48,6.98)
  Bottom Layer w0.254: v1(38.48,6.98) 38.48,6.03 37.63,5.18 34.83,5.18 34.48,5.54 26.03,5.54 25.78,5.28 23.41,5.28 19.89,8.8 19.89,19.94 19.63,20.19 15.62,20.19 13.72,22.1 13.72,28.96 12.95,29.72 PB0.16
PC0: length 33.9
  Top Layer w0.254: v1(22.99,24.77) 22.99,24.45 25.87,21.56 26.82,21.56 27.89,20.5 STM32.8 ; PC0.1 46.86,25.91 v1(41.15,25.91)
  Bottom Layer w0.254: v1(22.99,24.77) 22.73,25.02 22.73,25.53 23.24,26.03 24.1,26.03 24.35,26.29 38.67,26.29 39.31,25.65 40.89,25.65 v1(41.15,25.91)
PC1: length 40.4
  Top Layer w0.254: STM32.9 26.57,21.21 25.4,21.21 v1(22.99,23.62) ; v1(39.5,26.29) 40.29,26.29 40.67,26.67 41.73,26.67 42.12,26.29 42.61,26.29 42.89,26.57 49.63,26.57 50.29,25.91 PC0.2
  Bottom Layer w0.254: v1(39.5,26.29) 39.03,26.76 24.32,26.76 23.95,26.39 21.95,26.39 21.34,25.78 21.34,24.7 22.41,23.62 v1(22.99,23.62)
PC2: length 55.5
  Top Layer w0.254: PC0.3 49.15,23.88 50,23.88 50.13,23.75 50.93,23.75 51.47,24.3 51.47,26.63 51.18,26.92 v1(42.42,26.92) ; v1(23.24,22.48) 24.87,20.85 26.22,20.85 STM32.10
  Bottom Layer w0.254: v1(42.42,26.92) 41.36,26.92 41.03,26.59 40.14,26.59 39.62,27.12 24.17,27.12 23.8,26.75 21.78,26.75 21.38,26.34 19.09,26.34 18.68,25.93 17.68,25.93 17.27,25.53 17.27,24.13 17.65,23.75 21.78,23.75 23.05,22.48 v1(23.24,22.48)
PC3: length 55
  Top Layer w0.254: STM32.11 25.87,20.5 24.21,20.5 v1(22.35,22.35) ; v1(40.39,27.18) 41.78,27.18 42.11,27.51 42.66,27.51 42.89,27.28 51.33,27.28 51.83,26.78 51.83,24.01 PC0.4
  Bottom Layer w0.254: v1(40.39,27.18) 40.09,27.47 24.03,27.47 23.66,27.1 21.64,27.1 21.23,26.7 18.94,26.7 18.54,26.29 17.34,26.29 16.92,25.87 16.92,23.72 17.25,23.39 21.31,23.39 v1(22.35,22.35)
PC4: length 66.7
  Top Layer w0.254: PC0.5 49.02,21.21 51.05,21.21 51.47,20.79 51.47,19.14 52.18,18.43 52.18,1.51 51.93,1.26 31.89,1.26 31.24,1.91 31.24,3.68 30.95,3.97 29.3,3.97 28.56,4.71 23.58,4.71 23.17,5.13 23.17,11.03 23.82,11.68 26.95,11.68 STM32.24
PC5: length 59.8
  Top Layer w0.254: STM32.25 27.3,11.33 23.97,11.33 23.53,10.89 23.53,5.27 23.72,5.08 28.7,5.08 29.33,4.44 32.51,4.44 33.78,3.17 33.78,2.16 34.33,1.61 51.57,1.61 51.83,1.87 51.83,18.28 50.29,19.81 PC0.6
PC6: length 18
  Top Layer w0.254: v1(45.1,15.51) 46.99,17.4 PC0.7 ; 34.7,10.95 34.7,10.85 37.3,8.25 37.85,8.25 v1(38.61,9.02)
  Bottom Layer w0.254: v1(45.1,15.51) v1(38.61,9.02)
PC7: length 19.7
  Top Layer w0.254: 35.06,11.31 35.06,11.21 37.25,9.02 37.59,9.02 v1(37.85,9.27)
  Bottom Layer w0.254: PC0.8 49.66,17.4 48.48,16.22 46.9,16.22 46.86,16.26 v1(44.83,16.26) v1(37.85,9.27)
PC8: length 16.7
  Top Layer w0.254: v1(43.56,11.56) v1(41.4,13.72) ; v1(36.96,10.16) 36.91,10.16 STM32.39
  Bottom Layer w0.254: v1(41.4,13.72) 40.96,13.72 37.4,10.16 v1(36.96,10.16) ; v1(43.56,11.56) 44.45,11.56 PC0.9
PC9: length 18.7
  Top Layer w0.254: v1(37.34,10.92) 36.86,10.92 STM32.40 ; v1(45.97,15.24) 46.86,16.13 49.02,16.13 PC0.10 ; v1(43.94,13.21) 42.74,13.21 41.47,14.48 v1(41.02,14.48)
  Bottom Layer w0.254: v1(37.34,10.92) 40.89,14.48 v1(41.02,14.48) ; v1(45.97,15.24) v1(43.94,13.21)
PC10: length 13.2
  Top Layer w0.254: PC0.11 46.73,12.32 39.62,19.43 38.94,19.43 STM32.51
PC11: length 16.3
  Top Layer w0.254: STM32.52 38.61,19.81 39.74,19.81 46.05,13.5 49.11,13.5 PC0.12
PC12: length 26.5
  Top Layer w0.254: PC0.13 49.02,11.05 50.93,11.05 51.47,11.59 51.47,18 50.8,18.67 41.39,18.67 39.89,20.17 38.26,20.17 STM32.53
PC13: length 42.8
  Top Layer w0.254: v1(29.08,24.26) 29.08,23.65 STM32.2
  Bottom Layer w0.254: PC0.14 51.47,10.96 51.47,25.62 50.33,26.76 46.57,26.76 44.4,24.59 38.16,24.59 37.52,25.22 30.05,25.22 v1(29.08,24.26)
PC14_OSC32_IN: length 76.6
  Top Layer w0.254: 10.61,19.76 12.32,21.47 X4.2 13.5,22.94 20.51,22.94 21.28,23.71 21.28,26.88 22.23,27.83 24.09,27.83 25.2,26.72 25.23,26.72 26.29,25.65 v1(26.29,25.11) 26.29,24.26 26.67,23.88 28.05,23.88 29.66,22.27 STM32.3
  Bottom Layer w0.254: PC0.15 49.02,8.51 51.31,8.51 51.83,9.03 51.83,25.77 50.48,27.12 46.43,27.12 44.25,24.94 38.3,24.94 37.67,25.58 26.72,25.58 26.29,25.15
PC15_OSC32_OUT: length 77.7
  Top Layer w0.254: 9.98,18.4 10.57,18.4 X4.1 14.74,22.58 20.66,22.58 21.64,23.56 21.64,26.74 22.38,27.47 23.64,27.47 24.89,26.22 v1(24.89,25.58) 24.89,24.37 25.74,23.52 27.89,23.52 29.4,22.01 STM32.4
  Bottom Layer w0.254: v1(24.89,25.58) 25.25,25.93 38.07,25.93 38.71,25.3 44.1,25.3 46.28,27.47 50.63,27.47 52.18,25.92 52.18,8.88 51.31,8.01 51.31,7.48 51.07,7.24 PC0.16
PD2: length 94.8
  Top Layer w0.254: STM32.54 36.83,19.54 38.58,21.29 38.58,26.2 40.25,27.86 42.81,27.86 43.04,27.63 51.48,27.63 52.18,26.93 52.18,18.93 52.54,18.58 52.54,1.37 52.08,0.9 31.74,0.9 31.39,1.26 8.14,1.26 PD2.2
PF0_OSC_IN: length 32.1
  Top Layer w0.254: X3.1 12.02,18.61 15.48,22.07 20.65,22.07 22,23.41 22,26.57 22.54,27.12 23.49,27.12 23.93,26.68 23.93,24.83 25.59,23.16 27.44,23.16 29.05,21.56
  Top Layer w0.508: C13.2 13.08,14.88 X3.1
PF1_OSC_OUT: length 39.4
  Top Layer w0.254: STM32.6 27.09,22.81 25.45,22.81 23.57,24.68 23.57,26.33 23.14,26.76 22.69,26.76 22.35,26.43 22.35,23.27 20.71,21.63 15.54,21.63 12.57,18.66 12.57,17.78 13.13,17.22 14.88,17.22 15.05,17.06 15.05,15.19 15.37,14.88 19.85,14.88 20.48,15.51
  Top Layer w0.508: X3.2 20.48,15.51 C14.2
PF4: length 27.8
  Top Layer w0.254: 25.51,14.49 25.41,14.49 24.39,13.46 23.08,13.46 21.39,11.77 21.39,3.61 21.08,3.3 21.08,1.87 20.83,1.61 10.32,1.61 PD2.1
UD+: length 7
  Top Layer w0.254: U9.1 10.41,10.29 10.16,10.03 10.16,9.65 10.03,9.52 9.78,9.52 9.65,9.65 9.65,10.41 9.58,10.49 9.22,10.49 9.02,10.29 9.02,9.78 8.76,9.52 8.49,9.52 8.36,9.65 8.36,10.05 8,10.42 USB1.A7 USB1.B6
UD-: length 8
  Top Layer w0.254: U9.2 11.39,9.02 12.25,9.87 12.25,10.61 11.94,10.92 USB1.A6 USB1.B7
$1N492: length 6
  Top Layer w0.254: USB1.B5 7.16,8.89 6.16,8.89 5.28,8.01 5.28,5.22 5.55,4.95 R5.1
$1N493: length 1.6
  Top Layer w0.254: R6.1 8.75,11.92 USB1.A5
$1N4015: length 2.2
  Top Layer w0.508: 18.57,10.31 18.55,10.29 U9.8

## Copper pours and planes (outline as drawn; the poured copper is in the pictures)
GND on Top Layer: 0,32.64 53.72,32.64 53.72,-0.25 0,-0.25
GND on Top Layer: 0,32.64 53.72,32.64 53.72,-0.25 0,-0.25
GND on Bottom Layer: 0.24,32.64 53.47,32.64 53.47,0 0.24,0

## Text on the board
Top Silkscreen Layer: GND | V3.3 | V5.5 | PF4 | PB15 | PB5 | PC10 | PC5 | PC1 | PC15 | PA5 | PA15 | STM32 SMART PANEL | DESIGN BY YUKIL
